# EAGLE design master_devon.routed (EAGLE 7.1.0)
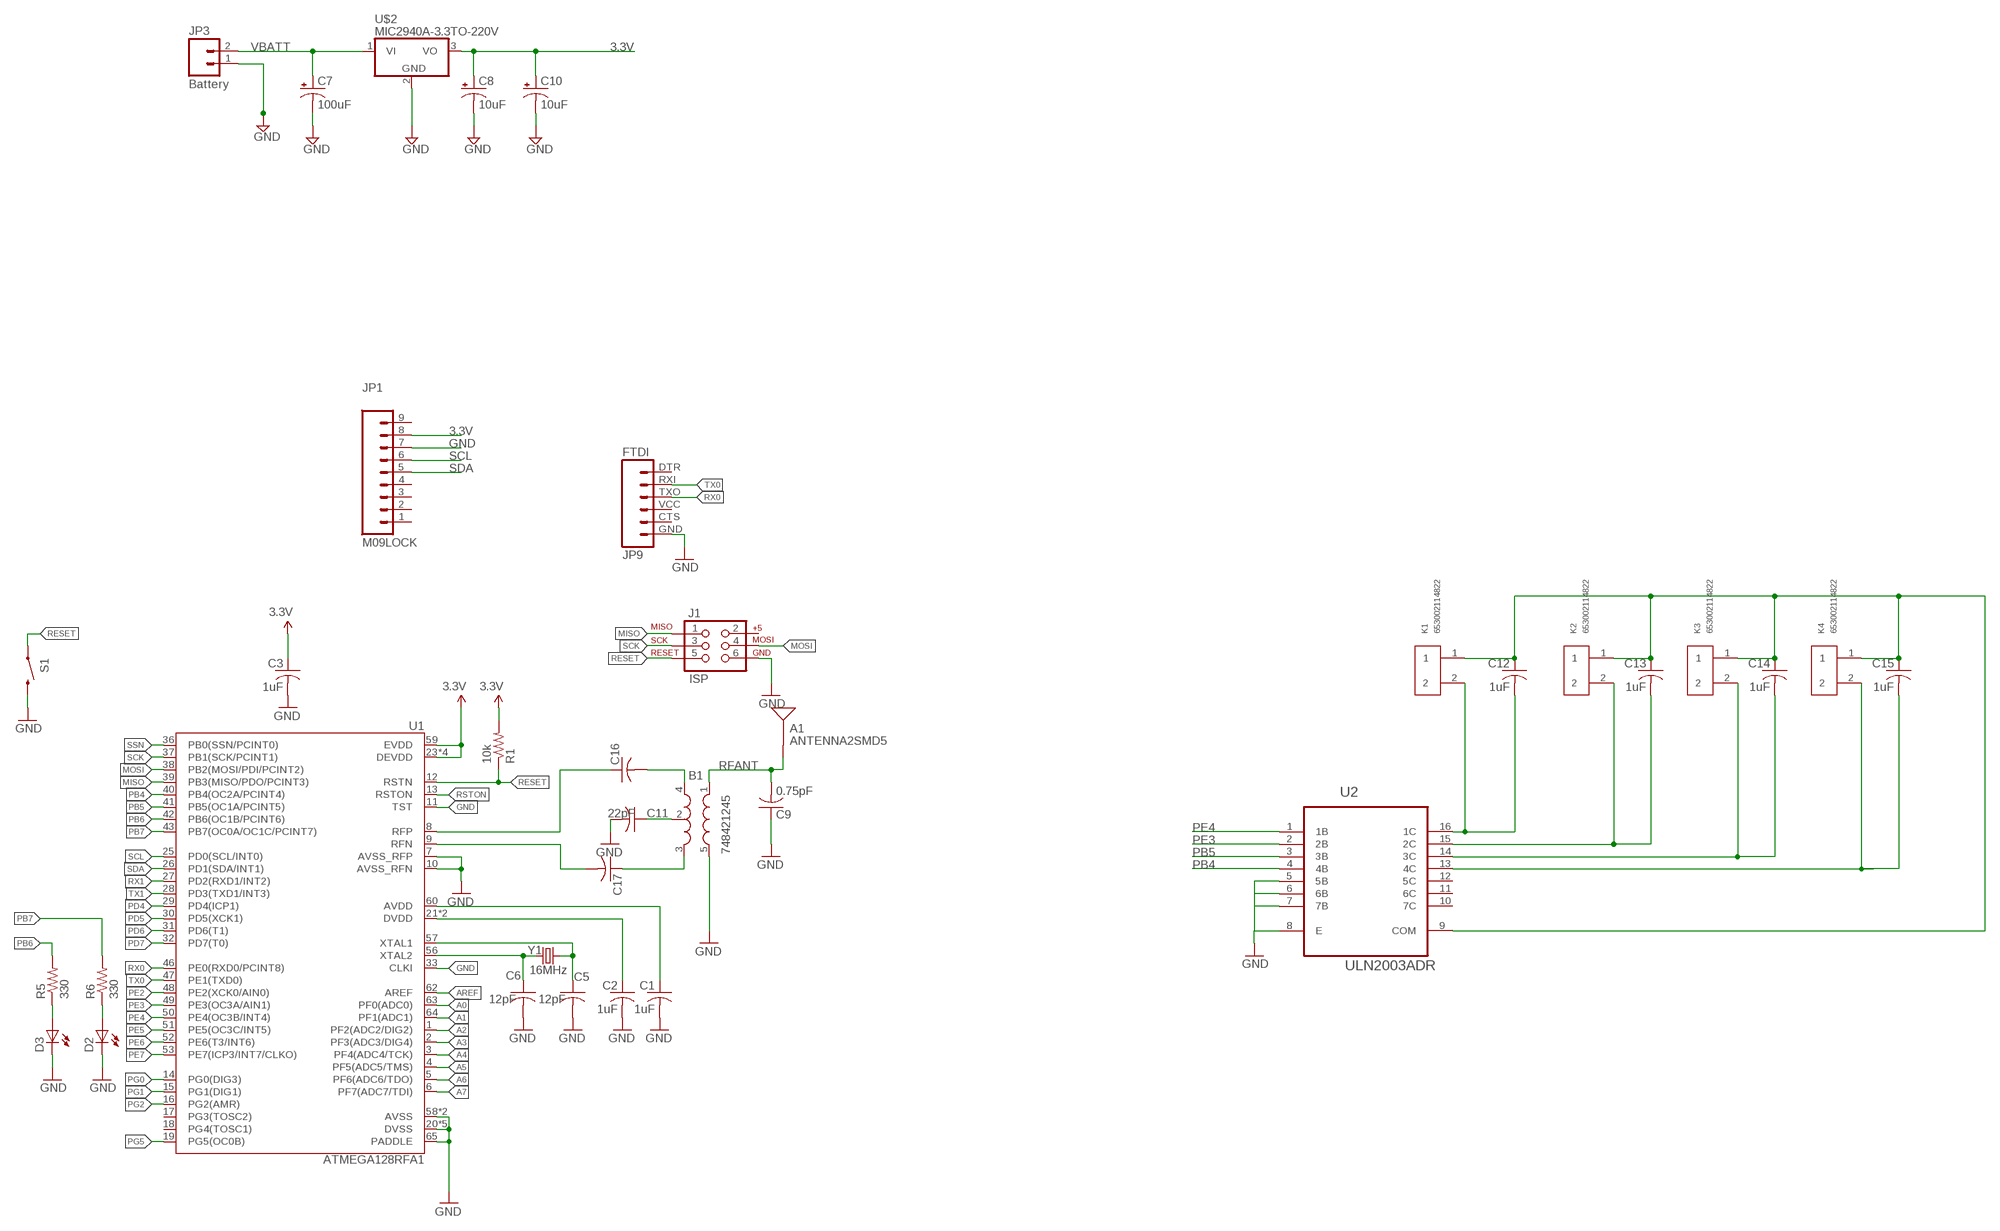
[diagram p0: schematic, sheet 1]

## Parts
A1  ANTENNA2SMD5  [ANTENNA-CHIP5]
B1  748421245  BALUN0805  [BALUN]
C1  1uF  C-USC0805  [C0805]
C2  1uF  C-USC0805  [C0805]
C3  1uF  C-USC0805  [C0805]
C5  12pF  C-USC0805  [C0805]
C6  12pF  C-USC0805  [C0805]
C7  100uF  CPOL-USE3.5-8  [E3,5-8]
C8  10uF  CPOL-USE2.5-5  [E2,5-5]
C9  0.75pF  C-USC0805  [C0805]
C10  10uF  CPOL-USE2.5-5  [E2,5-5]
C11  22pF  C-USC0805  [C0805]
C12  1uF  C-USC0805  [C0805]
C13  1uF  C-USC0805  [C0805]
C14  1uF  C-USC0805  [C0805]
C15  1uF  C-USC0805  [C0805]
C16  C-USC0805  [C0805]
C17  C-USC0805  [C0805]
D2  LEDCHIP-LED0805  [CHIP-LED0805]
D3  LEDCHIP-LED0805  [CHIP-LED0805]
J1  ISP  AVR_SPI_PRG_6NS  [2X3-NS]
JP1  M09LOCK  [1X09_LOCK]
JP3  Battery  M02PTH  [1X02]
JP9  FTDI  FTDI_BASICPTH  [FTDI_BASIC]
K1  653002114822  [653002114822]
K2  653002114822  [653002114822]
K3  653002114822  [653002114822]
K4  653002114822  [653002114822]
R1  10k  R-US_R0805  [R0805]
R5  330  R-US_R0805  [R0805]
R6  330  R-US_R0805  [R0805]
S1  SWITCH-MOMENTARY-2SMD  [TACTILE_SWITCH_SMD]
U1  ATMEGA128RFA1  [QFN-64]
U2  ULN2003ADR  [SOIC127P600X175-16N]
U$2  MIC2940A-3.3TO-220V  [TO-220V]
Y1  16MHz  CRYSTAL5X3  [CRYSTAL-SMD-5X3]

## Nets
3.3V: C3.1 C8.+ C10.+ JP1.8 R1.2 U1.23(DEVDD) U1.34(DEVDD) U1.44(DEVDD) U1.54(DEVDD) U1.59(EVDD) U$2.3(VO)
A0: U1.63(PF0(ADC0))
A1: U1.64(PF1(ADC1))
A2: U1.1(PF2(ADC2/DIG2))
A3: U1.2(PF3(ADC3/DIG4))
A4: U1.3(PF4(ADC4/TCK))
A5: U1.4(PF5(ADC5/TMS))
A6: U1.5(PF6(ADC6/TDO))
A7: U1.6(PF7(ADC7/TDI))
AREF: U1.62(AREF)
AVDD: C1.1 U1.60(AVDD)
DVDD: C2.1 U1.21(DVDD) U1.22(DVDD)
GND [GND]: B1.5(GND) C1.2 C2.2 C3.2 C5.2 C6.2 C7.- C8.- C9.1 C10.- C11.2 D2.C D3.C J1.6 JP1.7 JP3.1 JP9.GND S1.3 U1.7(AVSS_RFP) U1.10(AVSS_RFN) U1.11(TST) U1.20(DVSS) U1.24(DVSS) U1.33(CLKI) U1.35(DVSS) U1.45(DVSS) U1.55(DVSS) U1.58(AVSS) U1.61(AVSS) U1.65(PADDLE) U2.5(5B) U2.6(6B) U2.7(7B) U2.8(E) U$2.2(GND)
MISO: J1.1 U1.39(PB3(MISO/PDO/PCINT3))
MOSI: J1.4 U1.38(PB2(MOSI/PDI/PCINT2))
N$3: C5.1 U1.57(XTAL1) Y1.3
N$4: C6.1 U1.56(XTAL2) Y1.1
N$7: B1.2(GND) C11.1
N$8: D3.A R5.1
N$10: B1.4(OUT1) C16.2
N$11: B1.3(OUT2) C17.1
N$12 [VMOTOR]: C12.2 K1.2 U2.16(1C)
N$13: D2.A R6.1
N$14 [VMOTOR]: C13.2 K2.2 U2.15(2C)
N$15 [VMOTOR]: C14.2 K3.2 U2.14(3C)
N$16 [VMOTOR]: C15.2 K4.2 U2.13(4C)
PB4: U1.40(PB4(OC2A/PCINT4)) U2.4(4B)
PB5: U1.41(PB5(OC1A/PCINT5)) U2.3(3B)
PB6: R5.2 U1.42(PB6(OC1B/PCINT6))
PB7: R6.2 U1.43(PB7(OC0A/OC1C/PCINT7))
PD4: U1.29(PD4(ICP1))
PD5: U1.30(PD5(XCK1))
PD6: U1.31(PD6(T1))
PD7: U1.32(PD7(T0))
PE2: U1.48(PE2(XCK0/AIN0))
PE3: U1.49(PE3(OC3A/AIN1)) U2.2(2B)
PE4: U1.50(PE4(OC3B/INT4)) U2.1(1B)
PE5: U1.51(PE5(OC3C/INT5))
PE6: U1.52(PE6(T3/INT6))
PE7: U1.53(PE7(ICP3/INT7/CLKO))
PG0: U1.14(PG0(DIG3))
PG1: U1.15(PG1(DIG1))
PG2: U1.16(PG2(AMR))
PG5: U1.19(PG5(OC0B))
RESET: J1.5 R1.1 S1.1 U1.12(RSTN)
RFANT [RFSIG]: A1.FEED(SIGNAL) B1.1(IN) C9.2
RFN: C17.2 U1.9(RFN)
RFP: C16.1 U1.8(RFP)
RSTON: U1.13(RSTON)
RX0: JP9.TXO U1.46(PE0(RXD0/PCINT8))
RX1: U1.27(PD2(RXD1/INT2))
SCK: J1.3 U1.37(PB1(SCK/PCINT1))
SCL: JP1.6 U1.25(PD0(SCL/INT0))
SDA: JP1.5 U1.26(PD1(SDA/INT1))
SSN: U1.36(PB0(SSN/PCINT0))
TX0: JP9.RXI U1.47(PE1(TXD0))
TX1: U1.28(PD3(TXD1/INT3))
VBATT [VBATT]: C7.+ C12.1 C13.1 C14.1 C15.1 JP3.2 K1.1 K2.1 K3.1 K4.1 U2.9(COM) U$2.1(VI)
Unconnected: J1.2 JP1.1 JP1.2 JP1.3 JP1.4 JP1.9 JP9.CTS JP9.DTR JP9.VCC U1.17(PG3(TOSC2)) U1.18(PG4(TOSC1)) U2.10(7C) U2.11(6C) U2.12(5C)

## Library data of the parts
A1 = SparkFun-RF:ANTENNA2: Chip antenna Single endded antenna. Common with smaller chip antennas. CHIP4 package is the GPS Chip Antenna SKU: GPS-08418. CHIP5 package is 2.4GHz chip antenna SKU: WRL-00144.
B1 = SparkFun-RF:BALUN: 0805 footprint balun- Ember 351/357
C1-C3 C5 C6 C9 C11-C17 = resistor:C-US: CAPACITOR, American symbol
C7 C8 C10 = rcl:CPOL-US: POLARIZED CAPACITOR, American symbol
D2 D3 = led:LED: LED OSRAM: - CHIPLED LG R971, LG N971, LY N971, LG Q971, LY Q971, LO R971, LY R971 LH N974, LH R974 LS Q976, LO Q976, LY Q976 LO Q996 - Hyper CHIPLED LW Q18S LB Q993, LB Q99A, LB R99A - SideLED LS A670, LO A670, LY A670, LG A670, LP A670 LB A673, LV A673, LT A673, LW A673 LH A674 LY A675 LS A676, LA A676, LO A676, LY A676, LW A676 LS A679, LY A679, LG A679 - Hyper Micro SIDELED® LS Y876, LA Y876, LO Y876, LY Y876 LT Y87S - SmartLED LW L88C, LW L88S LB L89C, LB L89S, LG L890 LS L89K, LO L89K, LY L89K LS L896, LA L896, LO L896, LY L896 - TOPLED LS T670, LO T670, LY T670, LG T670, LP T670 LSG T670, LSP T670, LSY T670, LOP T670, LYG T670 LG T671, LOG T671, LSG T671 LB T673, LV T673, LT T673, LW T673 LH T674 LS T676, LA T676, LO T676, LY T676, LB T676, LH T676, LSB T676, LW T676 LB T67C, LV T67C, LT T67C, LS T67K, LO T67K, LY T67K, LW E67C LS E67B, LA E67B, LO E67B, LY E67B, LB E67C, LV E67C, LT E67C LW T67C LS T679, LY T679, LG T679 LS T770, LO T770, LY T770, LG T770, LP T770 LB T773, LV T773, LT T773, LW T773 LH T774 LS E675, LA E675, LY E675, LS T675 LS T776, LA T776, LO T776, LY T776, LB T776 LHGB T686 LT T68C, LB T68C - Hyper Mini TOPLED® LB M676 - Mini TOPLED Santana® LG M470 LS M47K, LO M47K, LY M47K Source: http://www.osram.convergy.de LUXEON: - LUMILED® LXK2-PW12-R00, LXK2-PW12-S00, LXK2-PW14-U00, LXK2-PW14-V00 LXK2-PM12-R00, LXK2-PM12-S00, LXK2-PM14-U00 LXK2-PE12-Q00, LXK2-PE12-R00, LXK2-PE12-S00, LXK2-PE14-T00, LXK2-PE14-U00 LXK2-PB12-K00, LXK2-PB12-L00, LXK2-PB12-M00, LXK2-PB14-N00, LXK2-PB14-P00, LXK2-PB14-Q00 LXK2-PR12-L00, LXK2-PR12-M00, LXK2-PR14-Q00, LXK2-PR14-R00 LXK2-PD12-Q00, LXK2-PD12-R00, LXK2-PD12-S00 LXK2-PH12-R00, LXK2-PH12-S00 LXK2-PL12-P00, LXK2-PL12-Q00, LXK2-PL12-R00 Source: www.luxeon.com KINGBRIGHT: KA-3528ASYC Source: www.kingbright.com
J1 = SparkFun-Connectors:AVR_SPI_PRG_6: AVR ISP 6 Pin This is the reduced ISP connector for AVR programming. Common on Arduino. This footprint will take up less PCB space and can be used with a 10-pin to 6-pin adapter such as SKU: BOB-08508
JP1 = SparkFun-Connectors:M09: Header 9 Standard 9-pin 0.1" header. Use with straight break away headers (SKU : PRT-00116), right angle break away headers (PRT-00553), swiss pins (PRT-00743), machine pins (PRT-00117), and female headers (PRT-00115).
JP3 = SparkFun:M02: Header 2 Standard 2-pin 0.1" header. Use with straight break away headers (SKU : PRT-00116), right angle break away headers (PRT-00553), swiss pins (PRT-00743), machine pins (PRT-00117), and female headers (PRT-00115). Molex polarized connector foot print use with SKU : PRT-08233 with associated crimp pins and housings.
JP9 = SparkFun-Connectors:FTDI_BASIC: FTDI Basic header with labels
K1-K4 = Wuerth_Elektronik_eiCan_Wire_to_Board_Connectors:653002114822: WR-WTB 1.25mm Male Vertical Shrouded Header, 2 Pins=>Code : Con_WTB_1.25_PCB_THT_653002114822 <http://katalog.we-online.de/media/thumbs2/eican/thb_Con_WTB_1.25_PCB_THT_6530xx114822_pf2.jpg> Details see: http://katalog.we-online.de/en/em/653_0xx_114_822 Created 2014-06-06, Karrer Zheng 2014 (C) Würth Elektronik; OC_FARNELL: unknown
R1 R5 R6 = resistor:R-US_: RESISTOR, American symbol
S1 = SparkFun-Electromechanical:SWITCH-MOMENTARY-2: Various NO switches- pushbuttons, reed, etc
U1 = SparkFun-DigitalIC:ATMEGA128RFA1: ATmega128RFA1 8-bit AVR Microcontroller with Low Power 2.4GHz Transceiver for ZigBee and IEEE 802.15.4
U2 = Texas Instruments_By_element14_Batch_1:ULN2003ADR: 8-BIT SHIFT REGISTERS WITH 3-STATE OUTPUT REGISTERS; MPN: ULN2003ADR; OC_FARNELL: 1470513; OC_NEWARK: 77C3560; PACKAGE: SOIC-16; SUPPLIER: TEXAS INSTRUMENTS
U$2 = SparkFun:MIC2940A-3.3: MIC2940A-3.3 Voltage Regulator 3.3V mic2940.pdf
Y1 = SparkFun-FreqCtrl:CRYSTAL: Various standard crystals. Proven footprints. Spark Fun Electronics SKU : COM-00534

## Net classes
1 RFSIG: width 0.457 mm
2 VBATT: width 0.762 mm
3 VMOTOR: width 0.254 mm
4 GND: width 0.254 mm

## Board
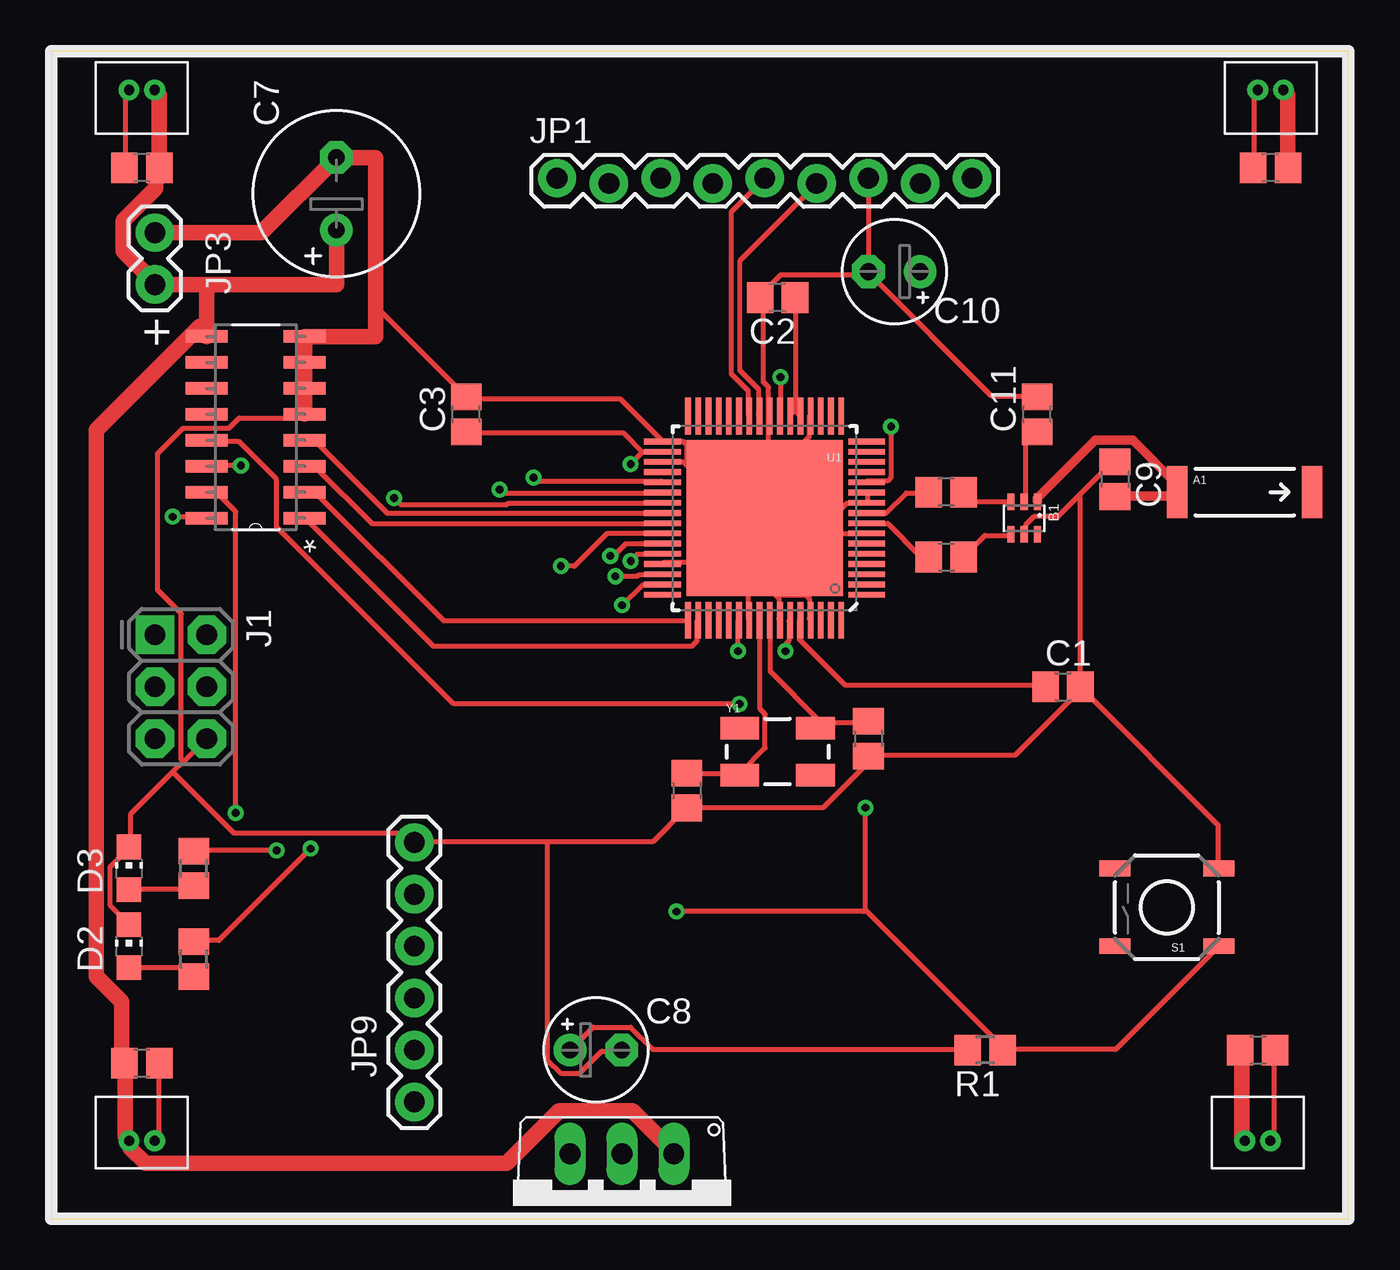
[diagram p1: board, top side]
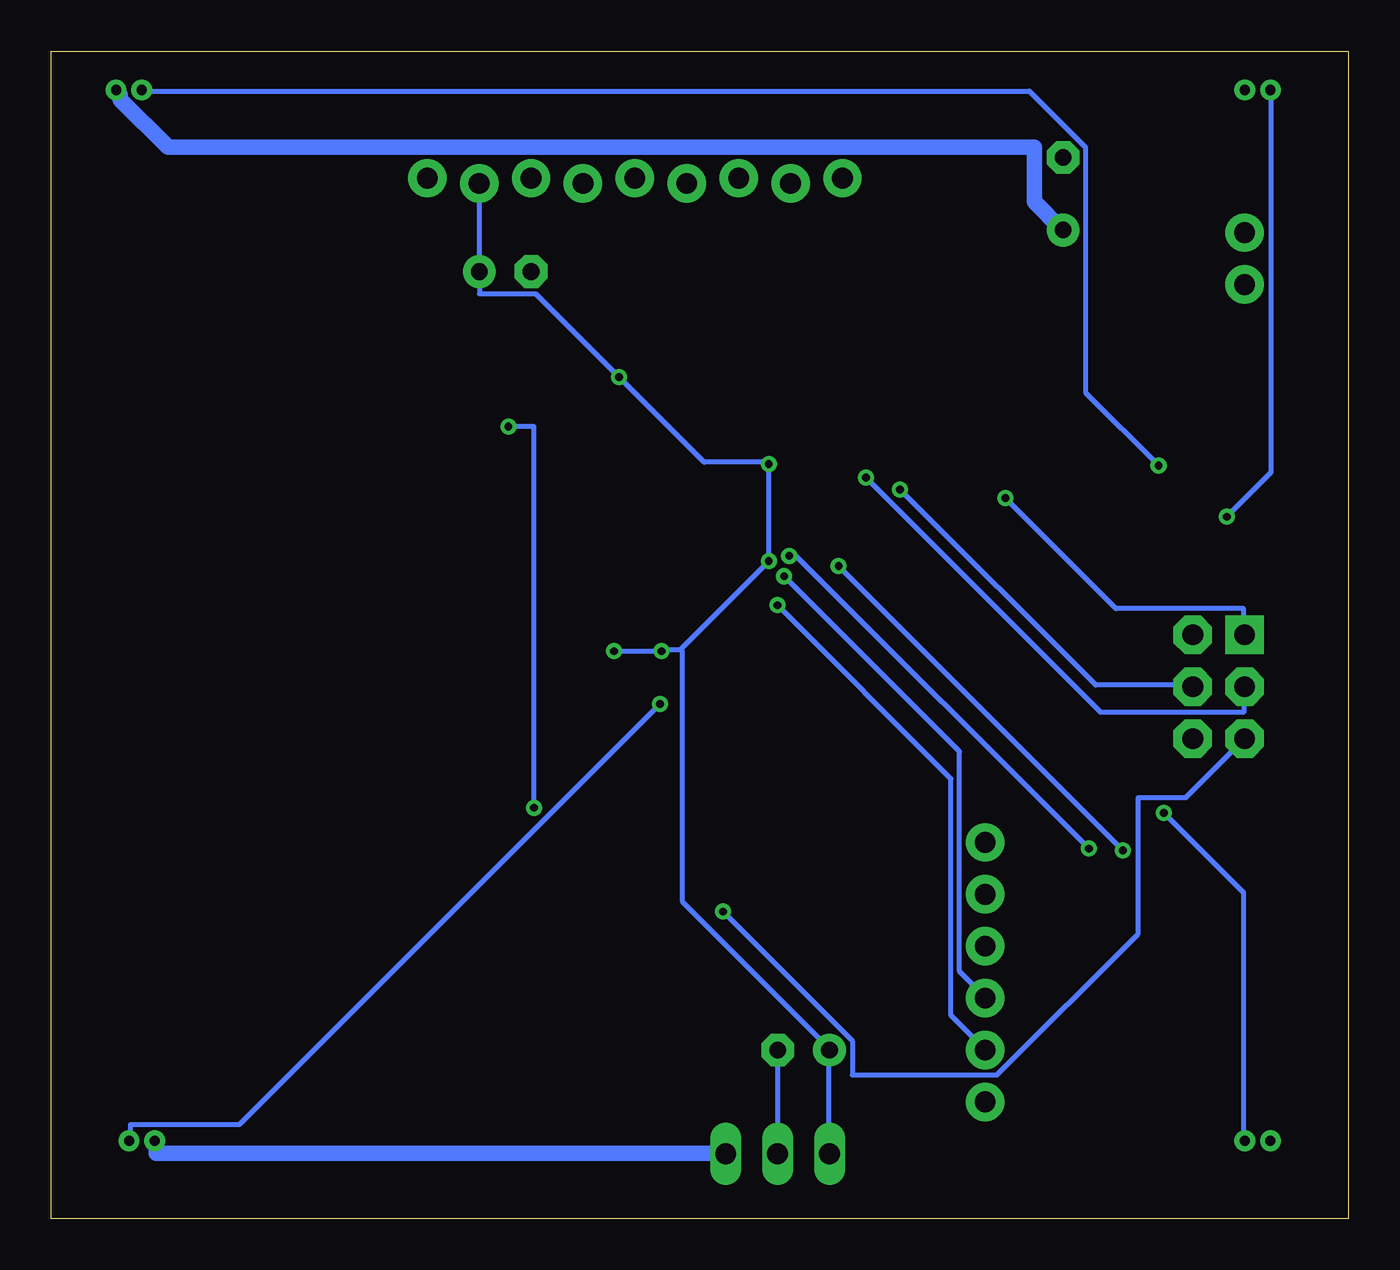
[diagram p2: board, bottom side, seen from below]

Size 63.5 x 57.15 mm. Coordinates in mm from the lower left corner, seen from the top.
Outline: 0,0 63.5,0 63.5,57.15 0,57.15 0,0
Copper layers (1*16): Top 0.035mm / dielectric 1.5mm / Bottom 0.035mm
Design rules "default *": minimum track width 10mil, minimum drill 15mil, track to track 6mil, track to pad 6mil, pad to pad 6mil, via to via 8mil, smd to smd 6mil, copper to edge 40mil, drill to drill 6mil, minimum pad ring 10mil, minimum via ring 8mil, stop-mask expansion 4mil, vias tented up to drill 0mil, thermal gap 10mil
tRestrict: area 55.9,33 to 61,38.1; area 61,37.5 to 63.5,38.1; area 61,33 to 63.5,33.7; area 54.6,37.5 to 55.9,38.1; area 50.8,33 to 55.9,33.7
bRestrict: area 40,30.5 to 63.5,38.1

### Footprints (pad centres in the part's own frame; a part is rotated, then mirrored left to right if it is on the bottom)
ANTENNA-CHIP5 = smd 1.016 x 2.54: FEED -3.302,0; NC 3.302,0
BALUN = smd 0.35 x 0.8: 1 -0.65,-0.8; 2 0,-0.8; 3 0.65,-0.8; 4 0.65,0.8; 5 0,0.8; 6 -0.65,0.8
C0805 = smd 1.3 x 1.5: 1 -0.85,0; 2 0.85,0
E3,5-8 = drill 0.813 pad 1.6: + -1.778,0 | drill 0.813 pad 1.6 octagon: - 1.778,0
E2,5-5 = drill 0.813 pad 1.6: + -1.27,0 | drill 0.813 pad 1.6 octagon: - 1.27,0
CHIP-LED0805 = smd 1.2 x 1.2: A 0,-1.05; C 0,1.05
2X3-NS = drill 1.016 pad 1.88 square: 1 -2.54,-1.27 | drill 1.016 pad 1.88 octagon: 2 -2.54,1.27; 3 0,-1.27; 4 0,1.27; 5 2.54,-1.27; 6 2.54,1.27
1X09_LOCK = drill 1.016 pad 1.88: 1 0,0.127; 2 2.54,-0.127; 3 5.08,0.127; 4 7.62,-0.127; 5 10.16,0.127; 6 12.7,-0.127; 7 15.24,0.127; 8 17.78,-0.127; 9 20.32,0.127
1X02 = drill 1.016 pad 1.88: 1 0,0; 2 2.54,0
FTDI_BASIC = drill 1.016 pad 1.88: CTS 10.16,0; DTR 0,0; GND 12.7,0; RXI 2.54,0; TXO 5.08,0; VCC 7.62,0
653002114822 = drill 0.5: 1 0.625,0; 2 -0.625,0
R0805 = smd 1.3 x 1.5: 1 -0.85,0; 2 0.85,0
TACTILE_SWITCH_SMD = smd 1.524 x 0.762: 1 -2.54,1.905; 2 2.54,1.905; 3 -2.54,-1.905; 4 2.54,-1.905
QFN-64 = smd 1.8 x 0.28: 1 -5,3.75; 2 -5,3.25; 3 -5,2.75; 4 -5,2.25; 5 -5,1.75; 6 -5,1.25; 7 -5,0.75; 8 -5,0.25; 9 -5,-0.25; 10 -5,-0.75; 11 -5,-1.25; 12 -5,-1.75; 13 -5,-2.25; 14 -5,-2.75; 15 -5,-3.25; 16 -5,-3.75; 33 5,-3.75; 34 5,-3.25; 35 5,-2.75; 36 5,-2.25; 37 5,-1.75; 38 5,-1.25; 39 5,-0.75; 40 5,-0.25; 41 5,0.25; 42 5,0.75; 43 5,1.25; 44 5,1.75; 45 5,2.25; 46 5,2.75; 47 5,3.25; 48 5,3.75 | smd 0.28 x 1.8: 17 -3.75,-5; 18 -3.25,-5; 19 -2.75,-5; 20 -2.25,-5; 21 -1.75,-5; 22 -1.25,-5; 23 -0.75,-5; 24 -0.25,-5; 25 0.25,-5; 26 0.75,-5; 27 1.25,-5; 28 1.75,-5; 29 2.25,-5; 30 2.75,-5; 31 3.25,-5; 32 3.75,-5; 49 3.75,5; 50 3.25,5; 51 2.75,5; 52 2.25,5; 53 1.75,5; 54 1.25,5; 55 0.75,5; 56 0.25,5; 57 -0.25,5; 58 -0.75,5; 59 -1.25,5; 60 -1.75,5; 61 -2.25,5; 62 -2.75,5; 63 -3.25,5; 64 -3.75,5 | smd 7.65 x 7.65: 65 0,0
SOIC127P600X175-16N = smd 2.057 x 0.61: 1 -4.801,8.89; 2 -4.801,7.62; 3 -4.801,6.35; 4 -4.801,5.08; 5 -4.801,3.81; 6 -4.801,2.54; 7 -4.801,1.27; 8 -4.801,0; 9 0,0; 10 0,1.27; 11 0,2.54; 12 0,3.81; 13 0,5.08; 14 0,6.35; 15 0,7.62; 16 0,8.89
TO-220V = drill 1.016 long: 1 -1.27,0; 2 1.27,0; 3 3.81,0
CRYSTAL-SMD-5X3 = smd 1.9 x 1.1: 1 -1.85,-1.15; 2 1.85,-1.15; 3 1.85,1.15; 4 -1.85,1.15

### Placement (x,y rotation side)
A1  58.42,35.56 0 top
B1  47.62,34.29 180 top
C1  49.53,26.04 0 top
C2  35.56,45.09 180 top
C3  20.32,39.37 90 top
C5  40.01,23.5 270 top
C6  31.12,20.96 270 top
C7  13.97,50.16 90 top
C8  26.67,8.26 0 top
C9  52.07,36.2 270 top
C10  41.27,46.36 180 top
C11  48.26,39.37 90 top
C12  4.45,51.44 180 top
C13  4.45,7.62 0 top
C14  59.69,51.44 180 top
C15  59.05,8.26 0 top
C16  43.81,32.39 0 top
C17  43.81,35.56 180 top
D2  3.81,13.34 0 top
D3  3.81,17.14 0 top
J1  6.35,26.04 270 top
JP1  24.77,50.8 0 top
JP3  5.08,48.26 270 top
JP9  17.78,5.72 90 top
K1  4.45,55.25 0 top
K2  4.45,3.81 180 top
K3  59.69,55.25 0 top
K4  59.05,3.81 180 top
R1  45.72,8.26 180 top
R5  6.99,17.14 90 top
R6  6.99,12.7 90 top
S1  54.61,15.24 180 top
U1  34.93,34.29 180 top
U2  7.62,43.18 180 top
U$2  29.21,3.18 180 top
Y1  35.56,22.86 0 top

### Tracks (layer width: path | path; a pad name or v marks a point on that pad's centre or on a via)
3.3V  (via drill 0.38)
  Top 0.254: R1.2 44.87,8.28 29.45,8.28 28.37,9.37 26.54,9.37 25.45,8.28 C8.+ | v35.7,41.19 35.7,39.36 U1.23 | 28.95,37.53 28.04,38.44 20.37,38.44 C3.1 | 28.95,37.53 29.87,37.53 U1.34 | v33.62,27.78 33.62,29.28 U1.54 | v35.95,27.78 35.95,28.11 36.12,28.28 36.12,29.28 U1.59 | v28.37,32.19 28.7,32.53 29.87,32.53 U1.44 | v28.37,36.94 28.87,37.44 28.95,37.53
  Bottom 0.254: U$2.3 25.45,3.2 25.45,8.2 C8.+ 25.45,8.37 32.62,15.53 32.62,27.78 32.7,27.86 | JP1.8 42.53,50.61 42.53,46.44 C10.+ 42.53,46.27 42.53,45.27 39.78,45.27 v35.7,41.19 35.62,41.11 31.54,37.03 28.45,37.03 v28.37,36.94 v28.37,32.19 32.7,27.86 | v35.95,27.78 v33.62,27.78 33.53,27.86 32.7,27.86
AVDD
  Top 0.254: C1.1 48.61,26.11 38.87,26.11 36.62,28.36 36.62,29.28 U1.60
DVDD
  Top 0.254: 36.45,39.52 36.45,45.02 C2.1 | 36.45,39.52 36.62,39.36 U1.21 | U1.22 36.2,39.36 36.37,39.52 36.45,39.52
GND
  Top 0.254: C11.2 48.2,40.27 46.03,40.27 40.03,46.27 C10.- | C10.- 39.95,46.19 35.7,46.19 34.78,45.27 34.78,45.11 C2.2 34.87,45.02 34.87,40.94 35.12,40.69 35.12,39.36 U1.24 35.12,39.27 35.12,34.03 U1.65 | JP1.7 40.03,50.86 40.03,46.44 C10.- | 15.88,44.36 16.21,44.36 20.29,40.27 C3.2 20.37,40.11 27.87,40.11 29.87,38.11 U1.33 29.95,38.03 30.95,38.03 31.12,37.86 31.12,37.03 U1.65 | U1.11 39.95,35.53 39.95,35.11 U1.10 39.87,35.03 38.95,35.03 37.53,33.61 U1.65 | U1.45 29.95,32.11 32.7,32.11 34.87,34.28 U1.65 | U1.55 34.12,29.36 34.12,33.36 U1.65 | U1.58 35.62,29.36 35.62,30.36 34.2,31.78 U1.65 | U1.61 37.12,29.36 37.12,30.36 36.95,30.53 35.62,30.53 U1.65 | U1.7 39.87,33.53 35.12,33.53 U1.65 | U1.35 29.95,37.03 30.95,37.03 34.2,33.78 U1.65 | U1.20 37.12,39.27 37.12,38.28 35.2,36.36 U1.65 | 50.28,35.36 52.03,37.11 C9.1 | 50.28,35.36 49.28,34.36 48.11,34.36 47.7,33.94 47.7,33.53 B1.5 | C1.2 50.36,26.11 50.36,35.28 50.28,35.36 | S1.3 57.11,17.2 57.11,19.28 50.45,25.95 C1.2 | D2.C 3.79,14.45 2.88,15.36 2.88,17.2 3.79,18.11 D3.C 3.88,18.28 3.88,19.78 5.96,21.86 | 6.46,22.36 7.54,23.45 J1.6 | 6.46,22.36 5.96,21.86 | 24.29,18.45 29.45,18.45 31.04,20.03 C6.2 31.12,20.11 37.78,20.11 39.95,22.28 39.95,22.61 C5.2 40.12,22.7 47.2,22.7 50.36,25.86 C1.2 | 24.29,18.45 17.79,18.45 JP9.GND 17.71,18.53 17.37,18.86 8.96,18.86 6.04,21.78 5.96,21.86 | 24.29,18.45 24.29,7.78 24.95,7.12 25.87,7.12 26.95,8.2 27.87,8.2 C8.- | U2.5 12.12,39.19 9.21,39.19 8.71,38.69 6.46,38.69 5.21,37.44 5.21,30.78 6.37,29.61 6.37,22.45 6.46,22.36
  Top 0.762: U2.5 U2.6 U2.7 U2.8 15.88,43.18 15.88,44.36 15.88,51.94 C7.- 10.29,48.26 JP3.1
  Bottom 0.254: U$2.2 27.95,3.2 27.95,8.2 C8.-
MISO  (via drill 0.38)
  Top 0.254: v16.79,35.28 17.12,34.94 22.29,34.94 22.37,35.03 29.87,35.03 U1.39
  Bottom 0.254: v16.79,35.28 11.37,29.86 5.12,29.86 5.12,28.61 J1.1
MOSI  (via drill 0.38)
  Top 0.254: v21.95,35.69 22.12,35.53 29.87,35.53 U1.38
  Bottom 0.254: v21.95,35.69 12.37,26.11 7.62,26.11 J1.4
N$3
  Top 0.254: C5.1 39.95,24.28 37.7,24.28 37.45,24.03 Y1.3 37.62,24.36 35.2,26.78 35.2,29.28 U1.57
N$4
  Top 0.254: C6.1 31.12,21.78 33.7,21.78 Y1.1 33.78,21.86 34.95,23.03 34.95,24.7 34.7,24.95 34.7,29.28 U1.56
N$7
  Top 0.254: B1.2 47.7,35.11 47.7,37.94 48.2,38.44 C11.1
N$8
  Top 0.254: D3.A 3.88,16.11 6.79,16.11 6.96,16.28 R5.1
N$10
  Top 0.254: B1.4 46.95,33.44 45.7,33.44 44.7,32.44 C16.2
N$11
  Top 0.254: B1.3 46.95,35.11 45.11,35.11 44.7,35.53 C17.1
N$12  (via drill 0.38)
  Top 0.254: C12.2 3.62,51.44 3.62,55.02 3.79,55.19 K1.2 | v5.96,34.36 7.54,34.36 U2.16
  Bottom 0.254: v5.96,34.36 3.79,36.53 3.79,55.19 K1.2
N$13
  Top 0.254: D2.A 3.88,12.28 6.54,12.28 6.96,11.87 R6.1
N$14  (via drill 0.38)
  Top 0.254: C13.2 5.29,4.03 5.12,3.87 K2.2 | v9.04,19.86 9.04,34.61 8.12,35.53 7.62,35.53 U2.15
  Bottom 0.254: v9.04,19.86 5.12,15.95 5.12,3.87 K2.2
N$15  (via drill 0.38)
  Top 0.254: C14.2 58.86,51.44 58.86,55.02 59.03,55.19 K3.2 | v9.29,36.86 7.62,36.86 U2.14
  Bottom 0.254: v9.29,36.86 12.87,40.44 12.87,52.44 15.62,55.19 59.03,55.19 K3.2
N$16  (via drill 0.38)
  Top 0.254: C15.2 59.86,8.2 59.86,4.03 59.69,3.87 K4.2 | v33.7,25.2 19.7,25.2 11.04,33.86 11.04,36.19 9.21,38.03 7.62,38.03 U2.13
  Bottom 0.254: v33.7,25.2 54.28,4.62 59.61,4.62 59.61,3.87 K4.2
PB4
  Top 0.254: U1.40 29.87,34.53 16.46,34.53 12.96,38.03 12.46,38.03 U2.4
PB5
  Top 0.254: U1.41 29.87,34.03 15.71,34.03 12.96,36.78 12.46,36.78 U2.3
PB6  (via drill 0.38)
  Top 0.254: v11.04,18.03 7.04,18.03 R5.2 | v24.95,31.94 25.62,31.94 27.2,33.53 29.87,33.53 U1.42
  Bottom 0.254: v24.95,31.94 v11.04,18.03
PB7  (via drill 0.38)
  Top 0.254: v12.71,18.11 8.21,13.61 7.04,13.61 R6.2 | v27.37,32.44 27.54,32.44 28.12,33.03 29.87,33.03 U1.43
  Bottom 0.254: v12.71,18.11 27.04,32.44 v27.37,32.44
PE3
  Top 0.254: U1.49 31.12,29.28 19.2,29.28 12.96,35.53 12.46,35.53 U2.2
PE4
  Top 0.254: U1.50 31.62,29.28 31.62,28.28 31.37,28.03 18.71,28.03 12.46,34.28 U2.1
RESET  (via drill 0.38)
  Top 0.254: S1.1 57.11,13.28 52.11,8.28 46.61,8.28 R1.1 46.61,8.37 39.87,15.11 | v41.12,38.78 41.12,36.28 40.95,36.11 39.95,36.11 U1.12 | 39.87,15.11 v39.87,20.11 | v30.62,15.03 39.78,15.03 39.87,15.11
  Bottom 0.254: v41.12,38.78 39.87,38.78 v39.87,20.11 | v30.62,15.03 24.29,8.7 24.29,7.03 17.21,7.03 10.29,13.95 10.29,20.61 7.96,20.61 5.12,23.45 J1.5
RFANT
  Top 0.457: B1.1 48.28,35.11 48.28,35.28 51.11,38.11 52.95,38.11 55.11,35.94 55.11,35.61 A1.FEED 55.03,35.36 52.11,35.36 C9.2
RFN
  Top 0.254: C17.2 42.95,35.53 41.87,35.53 40.87,34.53 39.95,34.53 U1.9
RFP
  Top 0.254: C16.1 42.95,32.44 42.53,32.44 40.95,34.03 39.95,34.03 U1.8
RX0  (via drill 0.38)
  Top 0.254: v27.62,31.44 28.7,31.44 28.79,31.53 29.87,31.53 U1.46
  Bottom 0.254: v27.62,31.44 19.04,22.86 19.04,12.12 17.79,10.87 JP9.TXO
SCK  (via drill 0.38)
  Top 0.254: v23.62,36.28 23.79,36.11 29.87,36.11 U1.37
  Bottom 0.254: v23.62,36.28 12.12,24.78 5.12,24.78 5.12,26.03 J1.3
SCL
  Top 0.254: U1.25 34.62,39.36 34.62,40.61 33.7,41.52 33.7,46.86 37.45,50.61 JP1.6
SDA
  Top 0.254: U1.26 34.12,39.36 34.12,40.52 33.28,41.36 33.28,49.27 34.87,50.86 JP1.5
TX0  (via drill 0.38)
  Top 0.254: v27.95,30.03 28.95,31.03 29.87,31.03 U1.47
  Bottom 0.254: v27.95,30.03 19.45,21.53 19.45,9.95 17.79,8.28 JP9.RXI
VBATT
  Top 0.762: 7.62,45.72 JP3.2 4.88,46.02 3.54,47.36 3.54,48.86 5.12,50.44 5.12,51.11 C12.1 5.29,55.02 5.12,55.19 K1.1 | 7.62,45.72 7.62,43.69 | 7.62,43.69 U2.9 | 7.62,45.72 13.97,45.72 C7.+ | C15.1 58.28,8.2 58.28,3.95 58.36,3.87 K4.1 | U$2.1 30.54,3.2 28.45,5.28 24.87,5.28 22.29,2.7 4.62,2.7 3.88,3.45 K2.1 3.79,3.87 3.62,4.03 3.62,7.62 C13.1 3.46,7.95 3.46,10.62 2.21,11.87 2.21,38.61 7.29,43.69 7.62,43.69 | C14.1 60.53,51.44 60.53,55.02 60.36,55.19 K3.1
  Bottom 0.762: U$2.1 30.54,3.2 58.36,3.2 58.36,3.78 K4.1 | K3.1 60.28,55.19 60.11,55.02 60.11,54.77 57.78,52.44 15.37,52.44 15.37,49.77 14.04,48.44 C7.+

### Text on the board
tPlace: +
tValues: +